# EAGLE design Gaga_Soundsystem2 (EAGLE 6.5.0)
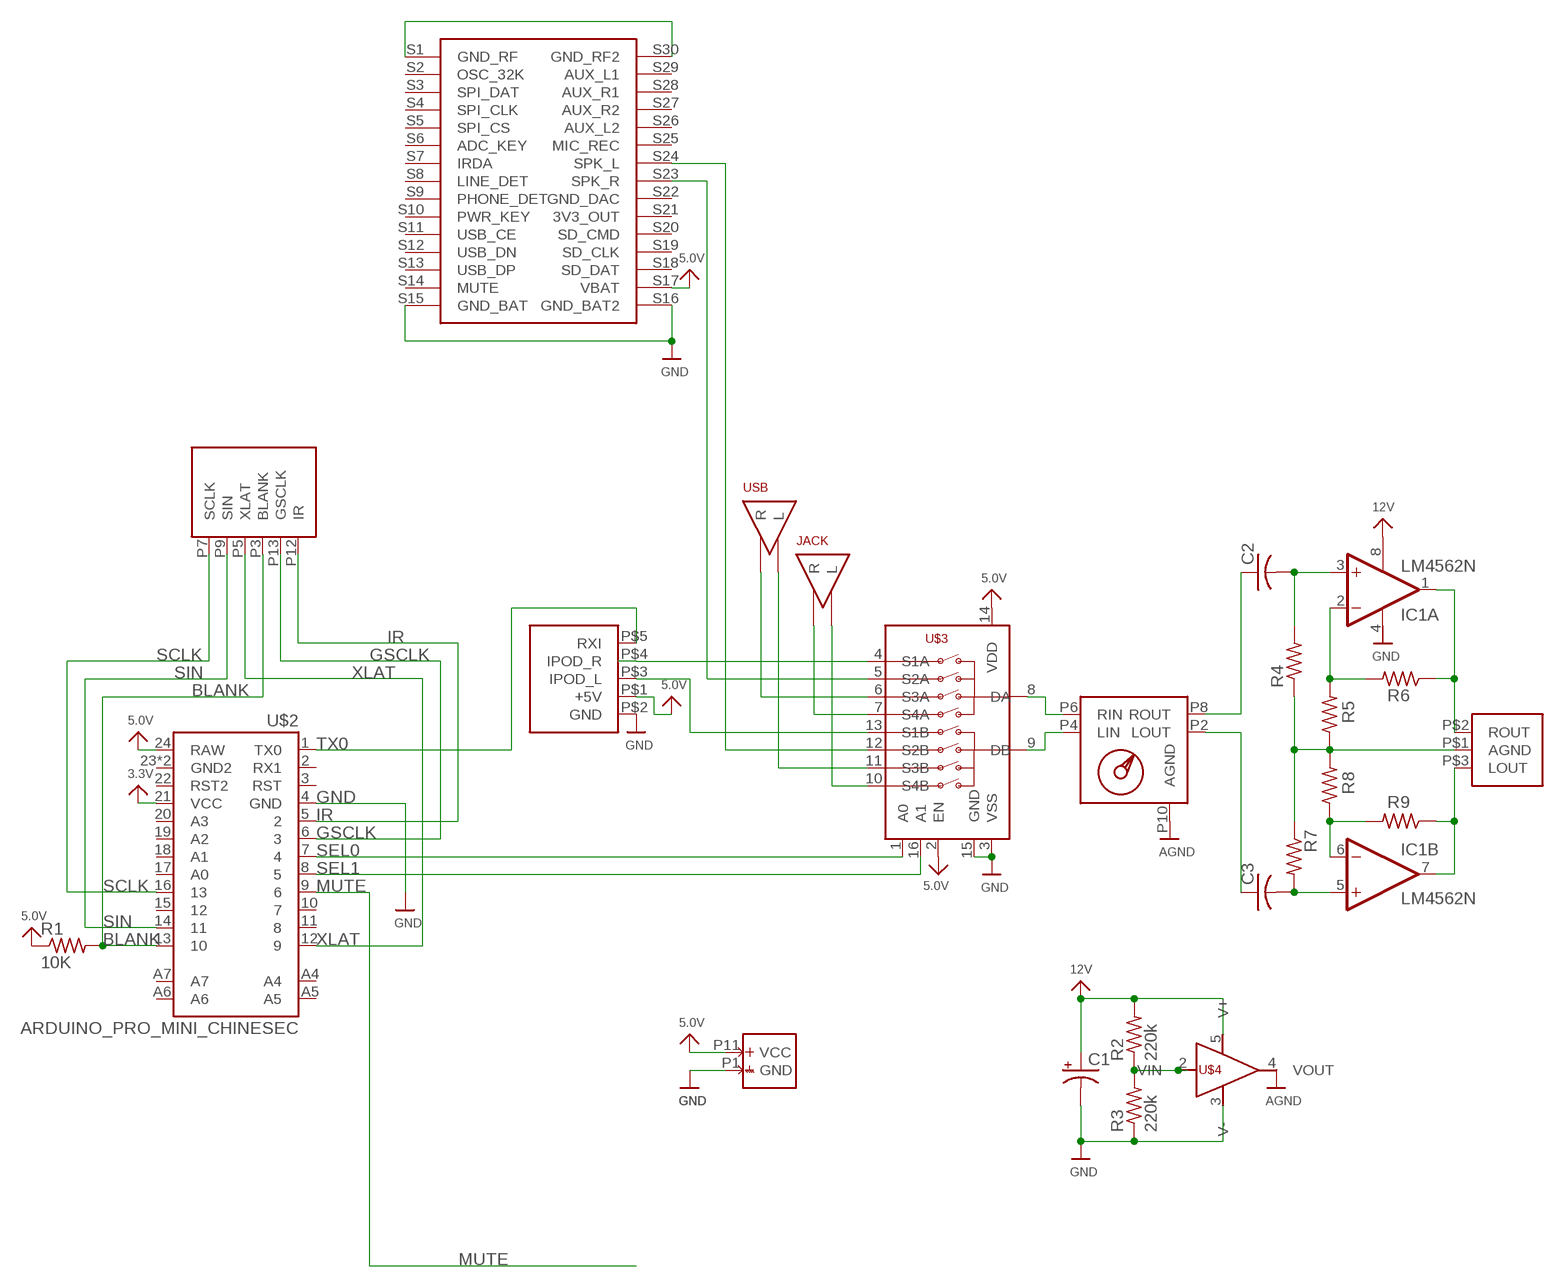
[diagram p0: schematic, sheet 1]

## Parts
C1  CPOL-USE5-13  [E5-13]
C2  C-US075-063X106  [C075-063X106]
C3  C-US075-063X106  [C075-063X106]
IC1  LM4562N  [DIL08]
JACK  AUDIOCON  [AUDIOCON]
R1  10K  R-US_0207/7  [0207/7]
R2  220k  R-US_0207/7  [0207/7]
R3  220k  R-US_0207/7  [0207/7]
R4  R-US_0207/7  [0207/7]
R5  R-US_0207/7  [0207/7]
R6  R-US_0207/7  [0207/7]
R7  R-US_0207/7  [0207/7]
R8  R-US_0207/7  [0207/7]
R9  R-US_0207/7  [0207/7]
U$1  OTHERSIDE  [OTHERSIDE]
U$2  ARDUINO_PRO_MINI_CHINESEC  [ARDUINO_PRO_MINI_CHINESE]
U$3  ADG709  [TSSOP16]
U$4  BUF634  [TO220]
U$5  IPODCON  [IPODCON]
U$6  AUDIOOUT  [AUDIOOUT]
U$7  SPK-E  [SPK-E]
USB  AUDIOCON  [AUDIOCON]

## Nets
3.3V: U$2.21(VCC)
5.0V: R1.1 U$1.P11(VCC) U$2.24(RAW) U$3.2(EN) U$3.14(VDD) U$5.P$1(+5V) U$7.S17(VBAT)
12V: C1.+ IC1.8(P:V+) R2.2 U$4.5(V+)
AGND: R4.1 R5.1 R7.1 R8.2 U$1.P10(AGND) U$4.4(VOUT) U$6.P$1(AGND)
BLANK: R1.2 U$1.P3(BLANK) U$2.13
BLUL: U$3.12(S2B) U$7.S24(SPK_L)
BLUR: U$3.5(S2A) U$7.S23(SPK_R)
GND: C1.- R3.1 U$1.P1(GND) U$2.4(GND) U$3.3(VSS) U$3.15(GND) U$4.3(V-) U$5.P$2(GND) U$7.S15(GND_BAT) U$7.S16(GND_BAT2)
GND_RF: U$7.S1(GND_RF) U$7.S30(GND_RF2)
GSCLK: U$1.P13(GSCLK) U$2.6
IPODL: U$3.13(S1B) U$5.P$3(IPOD_L)
IPODR: U$3.4(S1A) U$5.P$4(IPOD_R)
IR: U$1.P12(IR) U$2.5
JACKL: JACK.P$2(L) U$3.10(S4B)
JACKR: JACK.P$1(R) U$3.7(S4A)
LAMP: IC1.7(B:OUT) R9.1 U$6.P$3(LOUT)
LIN: U$1.P4(LIN) U$3.9(DB)
LOUT: C3.1 U$1.P2(LOUT)
MUTE: U$2.9
N$1: R2.1 R3.2 U$4.2(VIN)
N$8: IC1.2(A:-IN) R5.2 R6.2
N$9: C2.2 IC1.3(A:+IN) R4.2
N$10: IC1.6(B:-IN) R8.1 R9.2
N$14: C3.2 IC1.5(B:+IN) R7.2
RAMP: IC1.1(A:OUT) R6.1 U$6.P$2(ROUT)
RIN: U$1.P6(RIN) U$3.8(DA)
ROUT: C2.1 U$1.P8(ROUT)
SCLK: U$1.P7(SCLK) U$2.16
SEL0: U$2.7 U$3.1(A0)
SEL1: U$2.8 U$3.16(A1)
SIN: U$1.P9(SIN) U$2.14
TX0: U$2.1(TX0) U$5.P$5(RXI)
USBL: U$3.11(S3B) USB.P$2(L)
USBR: U$3.6(S3A) USB.P$1(R)
XLAT: U$1.P5(XLAT) U$2.12
Unconnected: U$2.2(RX1) U$2.3(RST) U$2.10 U$2.11 U$2.15 U$2.17(A0) U$2.18(A1) U$2.19(A2) U$2.20(A3) U$2.22(RST2) U$2.23(GND2) U$2.A4 U$2.A5 U$2.A6 U$2.A7 U$2.GND2 U$7.S2(OSC_32K) U$7.S3(SPI_DAT) U$7.S4(SPI_CLK) U$7.S5(SPI_CS) U$7.S6(ADC_KEY) U$7.S7(IRDA) U$7.S8(LINE_DET) U$7.S9(PHONE_DET) U$7.S10(PWR_KEY) U$7.S11(USB_CE) U$7.S12(USB_DN) U$7.S13(USB_DP) U$7.S14(MUTE) U$7.S18(SD_DAT) U$7.S19(SD_CLK) U$7.S20(SD_CMD) U$7.S21(3V3_OUT) U$7.S22(GND_DAC) U$7.S25(MIC_REC) U$7.S26(AUX_L2) U$7.S27(AUX_R2) U$7.S28(AUX_R1) U$7.S29(AUX_L1)

## Power pins joined to a net without a drawn wire
V-: IC1.4(P:V-)

## Library data of the parts
C1 = resistor:CPOL-US: POLARIZED CAPACITOR, American symbol
C2 C3 = resistor:C-US: CAPACITOR, American symbol
IC1 = LM4562:LM4562: OP AMP also LM158; LM258; LM2904 Source: http://cache.national.com/ds/LM/LM158.pdf
JACK USB = connector:AUDIOCON
R1-R9 = resistor:R-US_: RESISTOR, American symbol
U$1 = connector:OTHERSIDE
U$2 = SparkFun-Boards:ARDUINO_PRO_MINI_CHINESE
U$3 = ADG709:ADG709
U$4 = BUF634:BUF634
U$5 = connector:IPODCON
U$6 = connector:AUDIOOUT
U$7 = BLK:SPK-E

## Net classes
0 default: clearance 0.355 mm

## Board
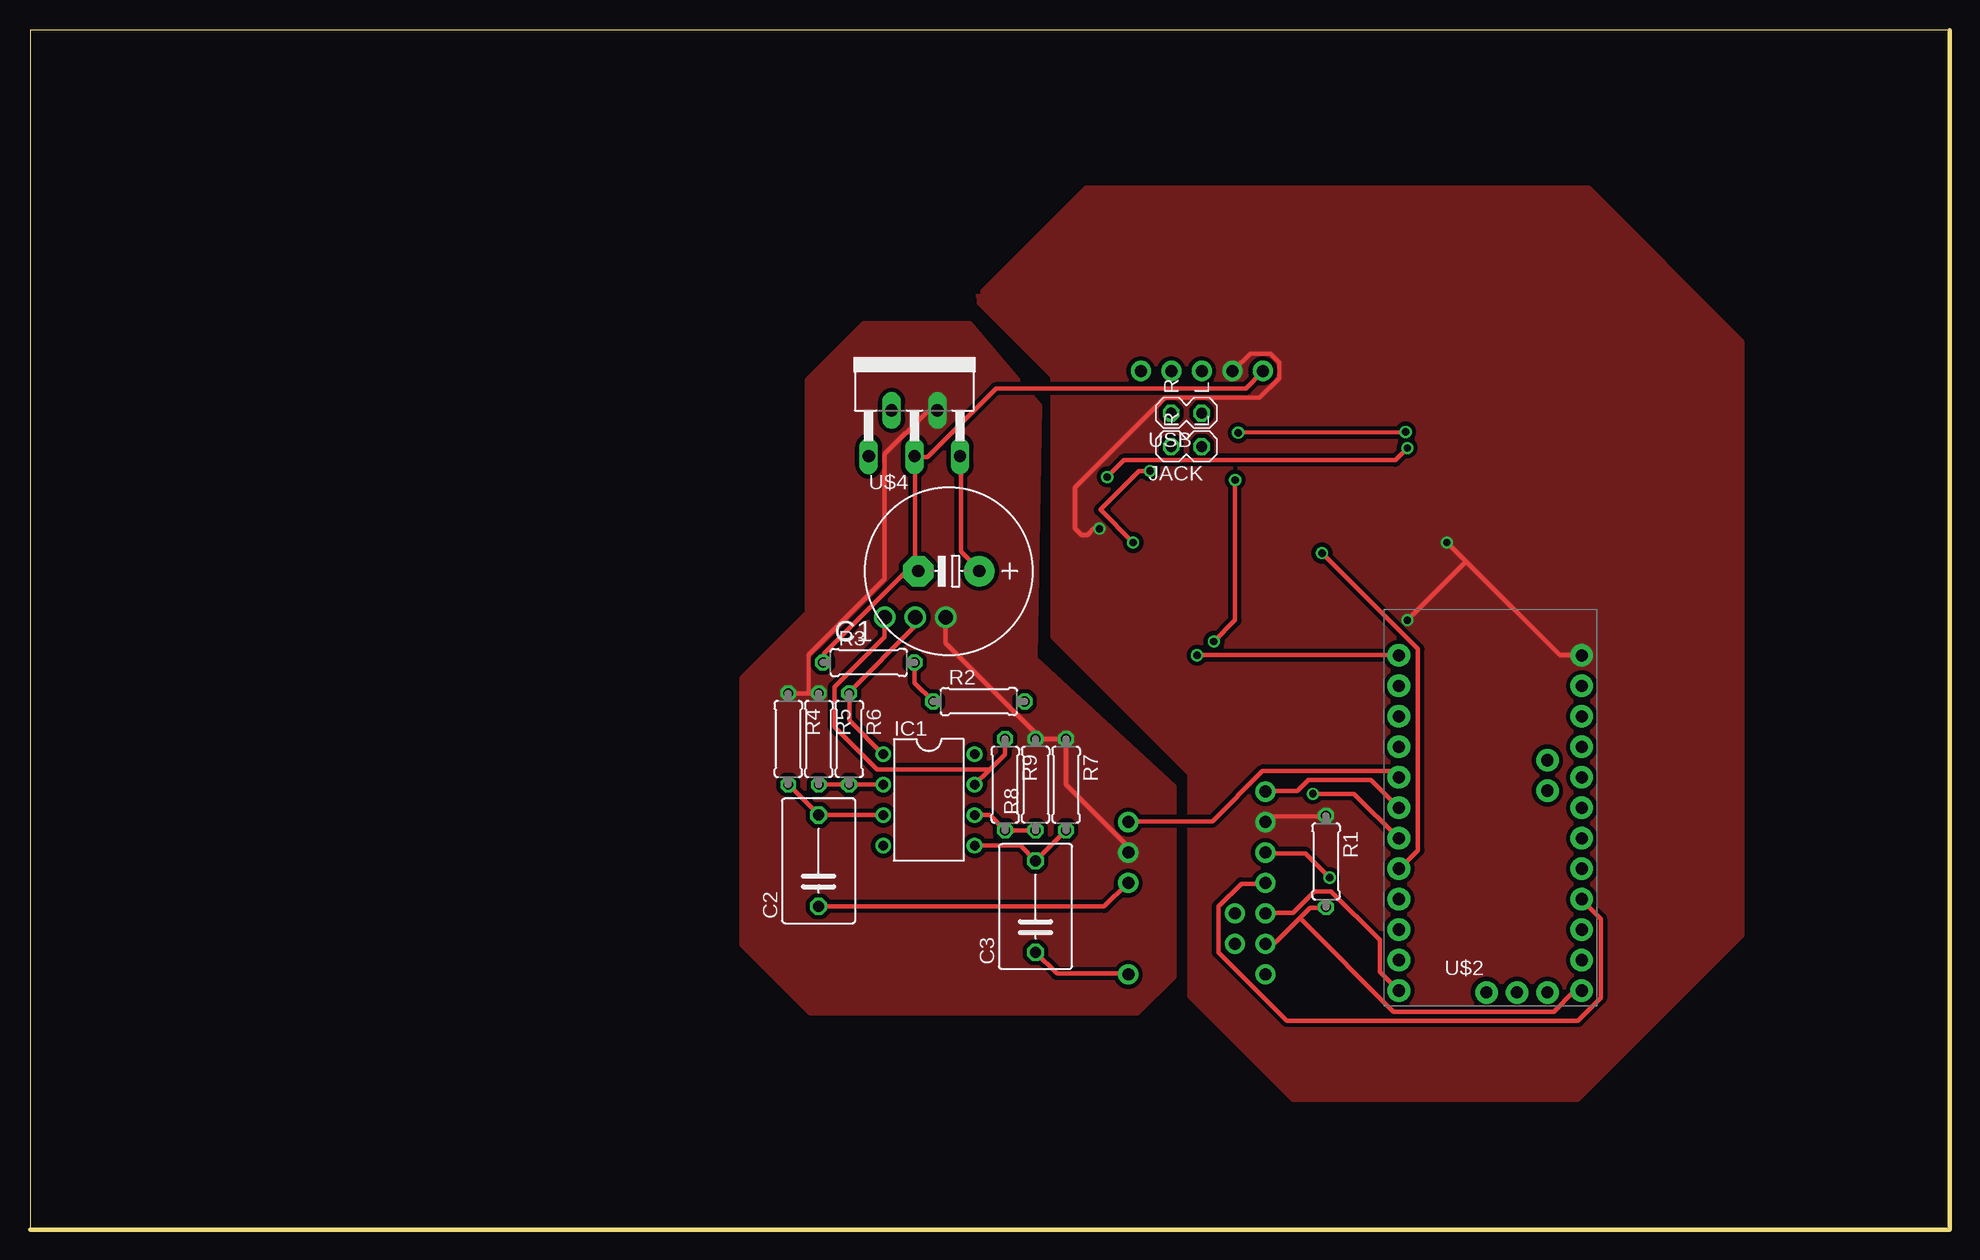
[diagram p1: board, top side]
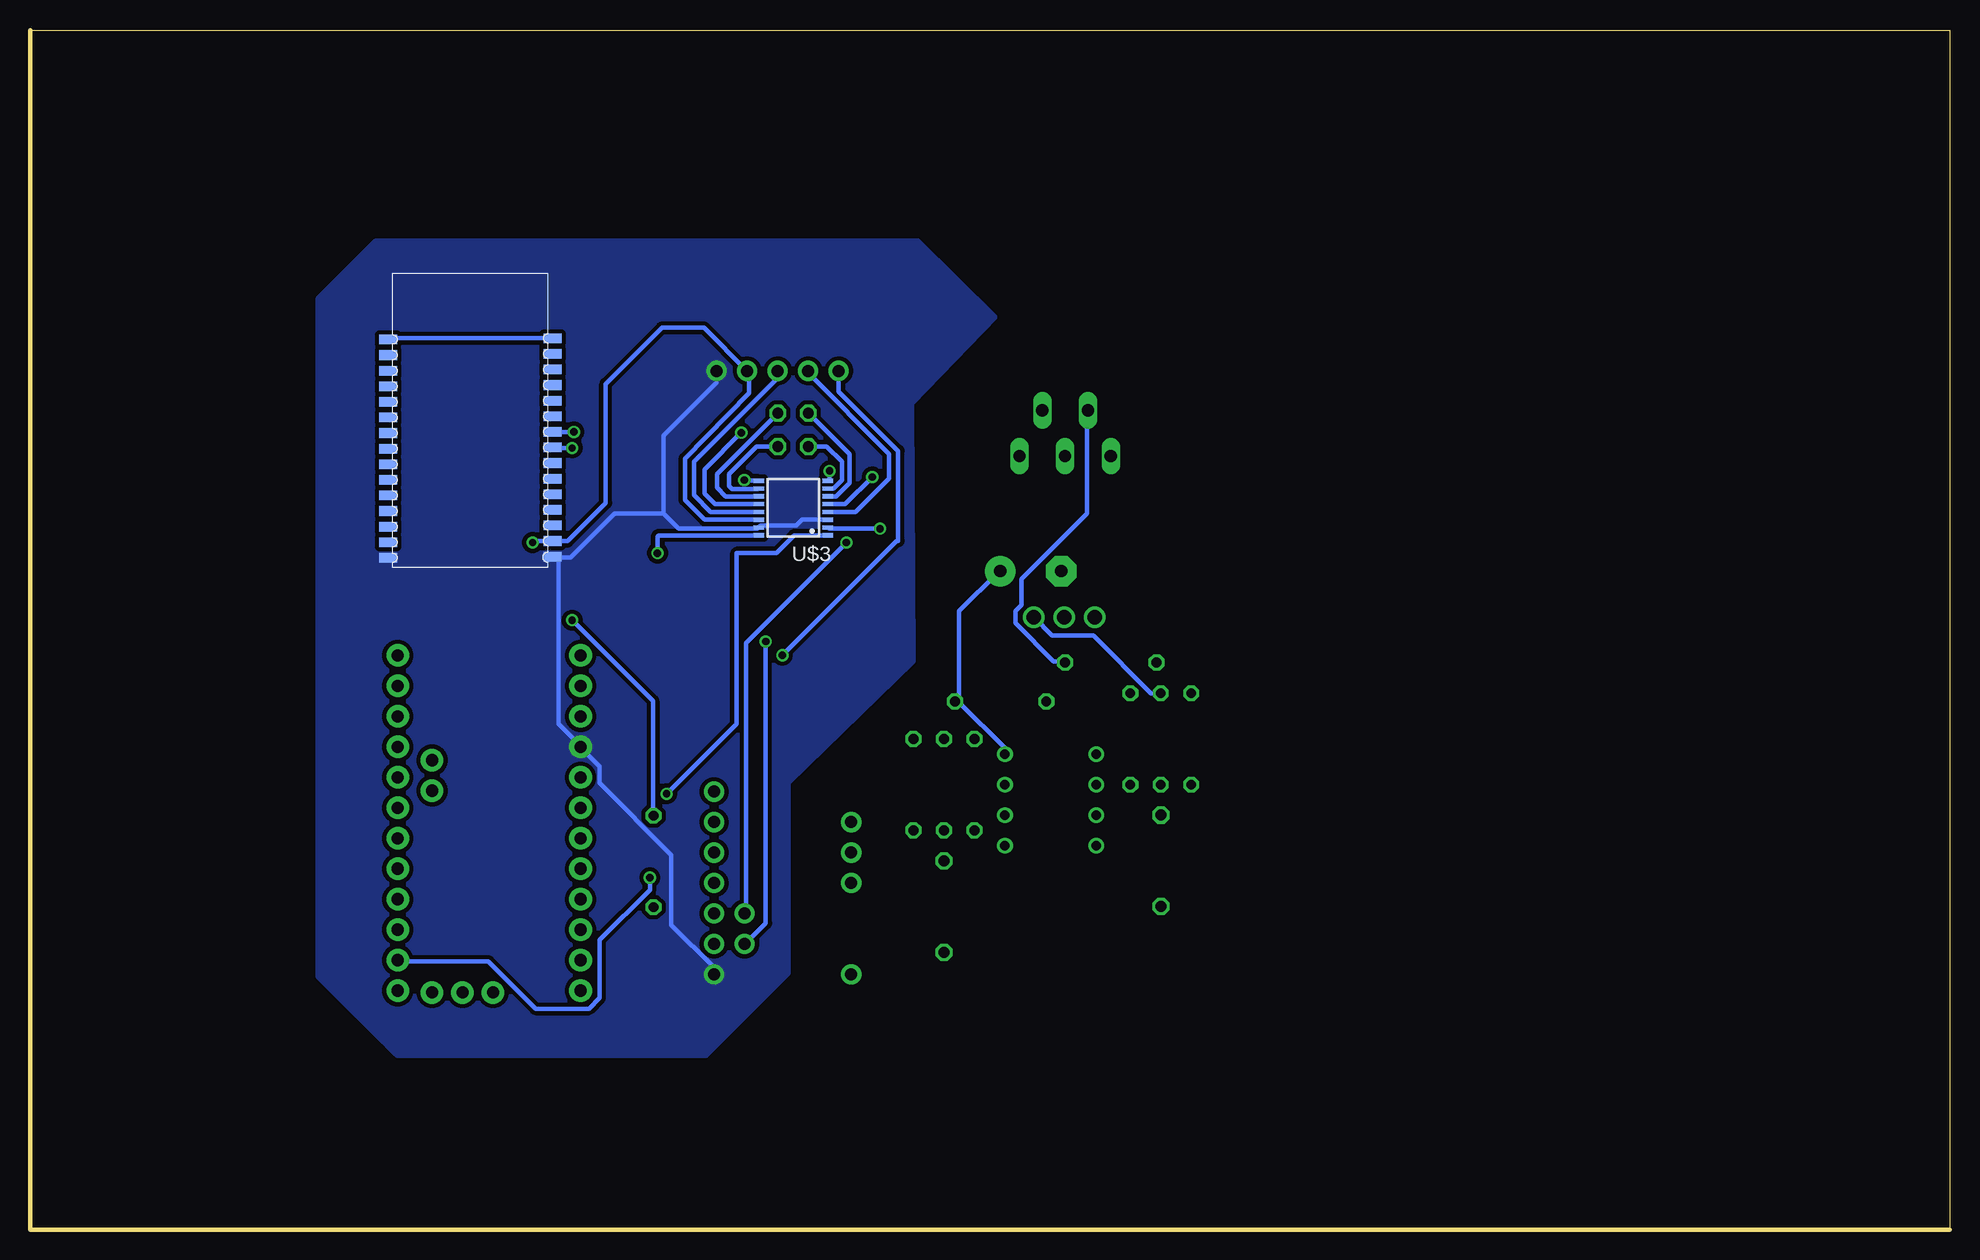
[diagram p2: board, bottom side, seen from below]

Size 160 x 100 mm. Coordinates in mm from the lower left corner, seen from the top.
Outline: 0,0 160,0 160,100 0,100 0,0
Copper layers (1*16): Top 0.035mm / dielectric 1.5mm / Bottom 0.035mm
Design rules "default *": minimum track width 14mil, minimum drill 24mil, track to track 12mil, track to pad 8mil, pad to pad 8mil, via to via 8mil, smd to smd 8mil, copper to edge 40mil, drill to drill 8mil, minimum pad ring 10mil, minimum via ring 8mil, stop-mask expansion 4mil, vias tented up to drill 0mil, thermal gap 10mil

### Footprints (pad centres in the part's own frame; a part is rotated, then mirrored left to right if it is on the bottom)
E5-13 = drill 1.016 pad 2.54: + -2.54,0 | drill 1.016 pad 2.54 octagon: - 2.54,0
C075-063X106 = drill 0.914 octagon: 1 -3.81,0; 2 3.81,0
DIL08 = drill 0.813 pad 1.27: 1 -3.81,-3.81; 2 -1.27,-3.81; 3 1.27,-3.81; 4 3.81,-3.81; 5 3.81,3.81; 6 1.27,3.81; 7 -1.27,3.81; 8 -3.81,3.81
AUDIOCON = drill 0.9 octagon: P$1 -1.27,0; P$2 1.27,0
0207/7 = drill 0.813 octagon: 1 -3.81,0; 2 3.81,0
OTHERSIDE = drill 1 pad 1.676: P1 1.27,10.16; P2 1.27,-1.27; P3 -1.27,10.16; P4 -1.27,7.62; P5 -3.81,10.16; P6 -3.81,7.62; P7 -6.35,10.16; P8 -6.35,-1.27; P9 -8.89,10.16; P10 -8.89,-1.27; P11 -11.43,10.16; P12 -11.43,-1.27; P13 -13.97,10.16
ARDUINO_PRO_MINI_CHINESE = drill 1.016 pad 1.88: 1 -7.62,12.7; 2 -7.62,10.16; 3 -7.62,7.62; 4 -7.62,5.08; 5 -7.62,2.54; 6 -7.62,0; 7 -7.62,-2.54; 8 -7.62,-5.08; 9 -7.62,-7.62; 10 -7.62,-10.16; 11 -7.62,-12.7; 12 -7.62,-15.24; 13 7.62,-15.24; 14 7.62,-12.7; 15 7.62,-10.16; 16 7.62,-7.62; 17 7.62,-5.08; 18 7.62,-2.54; 19 7.62,0; 20 7.62,2.54; 21 7.62,5.08; 22 7.62,7.62; 23 7.62,10.16; 24 7.62,12.7; A4 4.763,1.429; A5 4.763,3.969; A6 2.223,-15.399; A7 4.763,-15.399; GND2 -0.318,-15.399
TSSOP16 = smd 0.9 x 0.35: 1 -2.875,2.275; 2 -2.875,1.625; 3 -2.875,0.975; 4 -2.875,0.325; 5 -2.875,-0.325; 6 -2.875,-0.975; 7 -2.875,-1.625; 8 -2.875,-2.275; 9 2.875,-2.275; 10 2.875,-1.625; 11 2.875,-0.975; 12 2.875,-0.325; 13 2.875,0.325; 14 2.875,0.975; 15 2.875,1.625; 16 2.875,2.275
TO220 = drill 1.016 long: 1 -3.81,-8.255; 2 -1.905,-4.445; 3 0,-8.255; 4 1.905,-4.445; 5 3.81,-8.255
IPODCON = drill 1 pad 1.676: P$1 -2.54,0; P$2 -5.08,0; P$3 0,0; P$4 2.54,0; P$5 5.08,0
AUDIOOUT = drill 1.2: P$1 -2.54,0; P$2 0,0; P$3 2.54,0
SPK-E = smd 1.5 x 0.8: S1 -0.35,18.95; S2 -0.35,17.65; S3 -0.35,16.35; S4 -0.35,15.05; S5 -0.35,13.75; S6 -0.35,12.45; S7 -0.35,11.15; S8 -0.35,9.85; S9 -0.35,8.55; S10 -0.35,7.25; S11 -0.35,5.95; S12 -0.35,4.65; S13 -0.35,3.35; S14 -0.35,2.05; S15 -0.35,0.75; S16 13.35,0.85; S17 13.35,2.15; S18 13.35,3.45; S19 13.35,4.75; S20 13.35,6.05; S21 13.35,7.35; S22 13.35,8.65; S23 13.35,9.95; S24 13.35,11.25; S25 13.35,12.55; S26 13.35,13.85; S27 13.35,15.15; S28 13.35,16.45; S29 13.35,17.75; S30 13.35,19.05

### Placement (x,y rotation side)
C1  76.58,54.89 180 top
C2  65.75,30.73 90 top
C3  83.82,26.92 90 top
IC1  74.93,35.81 270 top
JACK  96.39,65.28 0 top
R1  108.03,30.69 270 top
R2  79.09,44.02 0 top
R3  69.91,47.27 0 top
R4  63.2,40.89 270 top
R5  65.75,40.89 270 top
R6  68.28,40.89 270 top
R7  86.36,37.08 270 top
R8  83.82,37.08 90 top
R9  81.28,37.08 270 top
U$1  92.81,22.53 270 top
U$2  121.72,35.16 0 top
U$3  96.38,60.15 180 bottom
U$4  73.72,72.73 0 top
U$5  97.68,71.58 180 top
U$6  73.79,51.05 180 top
U$7  129.79,55.24 0 bottom
USB  96.39,68.07 0 top

### Tracks (layer width: path | path; a pad name or v marks a point on that pad's centre or on a via)
5.0V  (via drill 0.6, 0.61)
  Top 0.356: R1.1 107.95,34.42 103.38,34.42 103,34.04 U$1.P11 | v89.15,58.42 88.65,58.42 88.14,57.91 87.63,57.91 87.12,58.42 87.12,61.85 94.61,69.34 102.49,69.34 104.14,70.99 104.14,72.26 103.38,73.03 101.73,73.03 100.33,71.63 U$5.P$1 | v118.11,57.28 119.7,55.69 | 119.7,55.69 127.51,47.88 129.29,47.88 U$2.24 | 119.7,55.69 v114.81,50.8
  Bottom 0.356: U$3.14 103.75,59.17 105.41,60.83 105.41,64.26 100.08,69.72 100.08,71.44 U$5.P$1 103.82,75.18 107.31,75.18 112.01,70.48 112.01,60.58 115.2,57.4 U$7.S17 117.99,57.4 v118.11,57.28 | v89.15,58.42 93.4,58.42 U$3.2 | v114.81,50.8 108.08,44.07 108.08,34.54 R1.1
  pour Top (no thermals): 79.38,77.72 79.38,78.23 88.01,86.87 129.92,86.87 142.75,74.04 142.75,24.51 129.03,10.79 105.28,10.79 96.65,19.43 96.65,37.97 85.22,49.4 85.22,71.12 79.12,77.22 79.12,77.72 78.99,77.85
12V
  Top 0.356: U$4.5 77.6,64.39 77.6,56.52 79.12,54.99 C1.+
  Bottom 0.356: IC1.8 78.74,40.13 82.55,43.94 82.8,43.94 R2.2 82.55,44.07 82.55,51.56 79.25,54.86 C1.+
AGND
  Top 0.356: R5.1 64.9,44.7 | 64.9,44.7 R4.1 | U$6.P$1 76.33,48.9 83.82,41.4 R8.2 R7.1 86.36,37.08 91.44,32 91.44,31.5 U$1.P10 | 64.9,44.7 64.9,47.88 71.25,54.23 71.25,64.64 74.8,68.2 75.56,68.2 U$4.4
  Bottom 0.356: R5.1 66.55,44.7 71.37,49.53 74.8,49.53 U$6.P$1
  pour Top (no thermals): 69.47,75.56 64.77,70.87 64.77,51.44 59.31,45.97 59.31,23.75 65.02,18.03 92.33,18.03 95.38,21.08 95.38,36.96 83.82,47.62 84.2,68.71 78.36,75.56
BLANK
  Top 0.356: 105.86,25.97 103.76,23.88 103,23.88 U$1.P3 | 105.86,25.97 106.68,26.8 107.95,26.8 R1.2 | 105.86,25.97 113.67,18.16 127,18.16 128.65,19.81 129.29,19.81 U$2.13
BLUL  (via drill 0.6)
  Top 0.356: v100.71,66.42 v114.67,66.5
  Bottom 0.356: U$3.12 102.89,60.48 103.76,61.34 103.76,63.37 v100.71,66.42 | v114.67,66.5 U$7.S24
BLUR  (via drill 0.6)
  Top 0.356: v114.81,65.15 113.79,64.14 91.19,64.14 v89.79,62.74
  Bottom 0.356: U$3.5 92.05,60.48 v89.79,62.74 | v114.81,65.15 116.33,65.15 U$7.S23
GND
  Top 0.356: R3.1 66.17,47.37 66.17,48.01 73.03,54.86 74.04,54.86 C1.- 73.79,54.99 73.79,64.39 U$4.3 73.91,64.39 74.8,64.39 80.52,70.1 101.35,70.1 102.74,71.5 U$5.P$2
  Bottom 0.356: U$3.3 95.64,59.17 96.14,58.67 99.11,58.67 U$3.15 99.36,58.42 105.92,58.42 107.19,59.69 | U$5.P$2 102.76,70.6 107.19,66.17 107.19,59.69 | 107.19,59.69 111.25,59.69 114.94,56.01 116.36,56.01 U$7.S16 | 116.71,55.83 U$7.S16 | U$1.P1 103,21.34 103,21.84 106.55,25.4 106.55,31.24 112.52,37.21 112.52,38.61 114.05,40.13 U$2.4 114.17,40.39 115.95,42.16 115.95,55.88 U$7.S16
  pour Bottom (no thermals): 79.5,76.07 86.49,68.83 86.36,47.37 96.77,37.21 96.77,21.34 103.63,14.48 129.41,14.48 136.02,21.08 136.02,77.6 131.19,82.42 85.98,82.42
GND_RF
  Bottom 0.356: U$7.S30 130.05,74.3 U$7.S1
GSCLK
  Top 0.356: U$1.P13 103,36.58 105.66,36.58 106.55,37.47 111.76,37.47 114.05,35.18 U$2.6
IPODL
  Bottom 0.356: U$5.P$3 97.81,70.85 104.65,64.01 104.65,61.21 103.25,59.82 U$3.13
IPODR
  Bottom 0.356: U$3.4 91.18,59.83 88.39,62.61 88.39,64.64 95.25,71.5 95.25,71.63 U$5.P$4
IR
  Top 0.356: U$1.P12 91.57,34.04 98.55,34.04 102.74,38.23 113.54,38.23 114.05,37.72 U$2.5
JACKL
  Bottom 0.356: JACK.P$2 99.44,65.28 101.73,62.99 101.73,61.98 101.47,61.72 99.33,61.72 U$3.10
JACKR
  Bottom 0.356: U$3.7 93.04,61.77 92.33,62.48 92.33,64.01 93.6,65.28 JACK.P$1
LAMP
  Top 0.356: R9.1 81.28,39.62 79.95,38.29 | IC1.7 79.95,38.29 | U$6.P$3 71.25,49.4 67.06,45.21 67.06,41.91 70.61,38.35 79.88,38.35 79.95,38.29
LIN  (via drill 0.6, 0.61)
  Top 0.356: v100.46,62.48 100.46,50.8 v98.68,49.02
  Bottom 0.356: U$3.9 99.89,62.42 v100.46,62.48 | v98.68,49.02 98.68,25.53 100.33,23.88 U$1.P4
LOUT
  Top 0.356: C3.1 85.6,21.34 91.44,21.34 U$1.P2
N$1
  Top 0.356: R3.2 73.74,47.24 73.74,45.57 75.26,44.04 R2.1
  Bottom 0.356: U$4.2 71.88,68.2 71.88,59.69 77.34,54.23 77.34,52.07 77.85,51.56 77.85,50.55 74.68,47.37 73.79,47.37 R3.2
N$8
  Top 0.356: R5.2 R6.2 IC1.2
N$9
  Top 0.356: R4.2 63.22,37.08 C2.2 IC1.3
N$10
  Top 0.356: IC1.6 80.01,34.54 R9.2 R8.1
N$14
  Top 0.356: IC1.5 82.55,32 C3.2 R7.2
RAMP
  Top 0.356: IC1.1 68.33,42.42 68.33,44.7 R6.1 68.33,44.83 73.79,50.29 U$6.P$2
RIN  (via drill 0.6, 0.61)
  Top 0.356: v93.34,63.25 92.46,63.25 89.22,60.01 v91.95,57.28
  Bottom 0.356: v93.34,63.25 93.34,62.48 U$3.8 | v91.95,57.28 100.33,48.9 100.33,26.42 U$1.P6
ROUT
  Top 0.356: C2.1 89.53,26.92 91.44,28.83 U$1.P8
SCLK
  Top 0.356: U$1.P7 102.87,28.83 100.97,28.83 99.06,26.92 99.06,23.11 104.78,17.4 129.03,17.4 130.94,19.3 130.94,25.91 129.41,27.43 U$2.16
SEL0  (via drill 0.61)
  Top 0.356: v106.93,36.32 110.36,36.32 114.05,32.64 U$2.7
  Bottom 0.356: U$3.1 96.3,57.88 97.79,56.39 101.09,56.39 101.09,42.16 v106.93,36.32
SEL1  (via drill 0.61)
  Top 0.356: v107.7,56.39 115.7,48.39 115.7,31.62 114.17,30.1 U$2.8
  Bottom 0.356: U$3.16 107.61,57.88 107.7,57.78 v107.7,56.39
SIN  (via drill 0.61)
  Top 0.356: v108.33,29.34 106.3,31.37 103,31.37 U$1.P9
  Bottom 0.356: v108.33,29.34 108.33,28.32 112.52,24.13 112.52,19.3 113.41,18.41 117.86,18.41 121.79,22.35 129.29,22.35 U$2.14
TX0  (via drill 0.61)
  Top 0.356: v97.28,47.88 114.05,47.88 U$2.1
  Bottom 0.356: U$5.P$5 92.6,69.86 87.63,64.9 87.63,57.4 87.76,57.4 v97.28,47.88
USBL
  Bottom 0.356: U$3.11 102.02,61.12 102.74,61.85 102.74,62.99 USB.P$2
USBR
  Bottom 0.356: U$3.6 92.8,61.12 91.69,62.23 91.69,64.64 USB.P$1
XLAT
  Top 0.356: U$1.P5 103,26.42 105.28,26.42 107.06,28.19 108.46,28.19 112.52,24.13 112.52,21.46 114.05,19.94 U$2.12